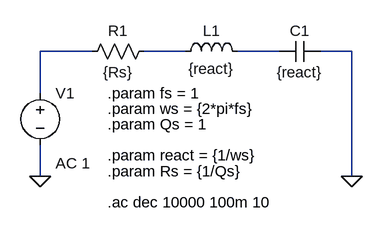
[diagram p0: schematic RLC Serie.asc]
RLC Serie.asc, the LTspice schematic file:
Version 4
SHEET 1 880 680
WIRE 64 144 -16 144
WIRE 208 144 144 144
WIRE 352 144 288 144
WIRE 464 144 416 144
WIRE -16 208 -16 144
WIRE -16 336 -16 288
WIRE 464 336 464 144
FLAG 464 336 0
FLAG -16 336 0
SYMBOL ind 192 160 R270
WINDOW 0 32 56 VTop 2
WINDOW 3 5 56 VBottom 2
SYMATTR InstName L1
SYMATTR Value {react}
SYMBOL cap 416 128 R90
WINDOW 0 0 32 VBottom 2
WINDOW 3 32 32 VTop 2
SYMATTR InstName C1
SYMATTR Value {react}
SYMBOL res 160 128 R90
WINDOW 0 0 56 VBottom 2
WINDOW 3 32 56 VTop 2
SYMATTR InstName R1
SYMATTR Value {Rs}
SYMBOL voltage -16 192 R0
WINDOW 123 24 124 Left 2
WINDOW 39 0 0 Left 0
SYMATTR InstName V1
SYMATTR Value ""
SYMATTR Value2 AC 1
TEXT 88 232 Left 2 !.param ws = {2*pi*fs}
TEXT 88 256 Left 2 !.param Qs = 1
TEXT 88 328 Left 2 !.param Rs = {1/Qs}
TEXT 88 304 Left 2 !.param react = {1/ws}
TEXT 88 376 Left 2 !.ac dec 10000 100m 10
TEXT 88 208 Left 2 !.param fs = 1

The netlist it stands for:
* RLC Serie.asc
L1 N002 N003 {react}
C1 0 N003 {react}
R1 N002 N001 {Rs}
V1 N001 0 AC 1
.param ws = {2*pi*fs}
.param Qs = 1
.param Rs = {1/Qs}
.param react = {1/ws}
.ac dec 10000 100m 10
.param fs = 1
.backanno
.end